# EAGLE design card (EAGLE 6.3)
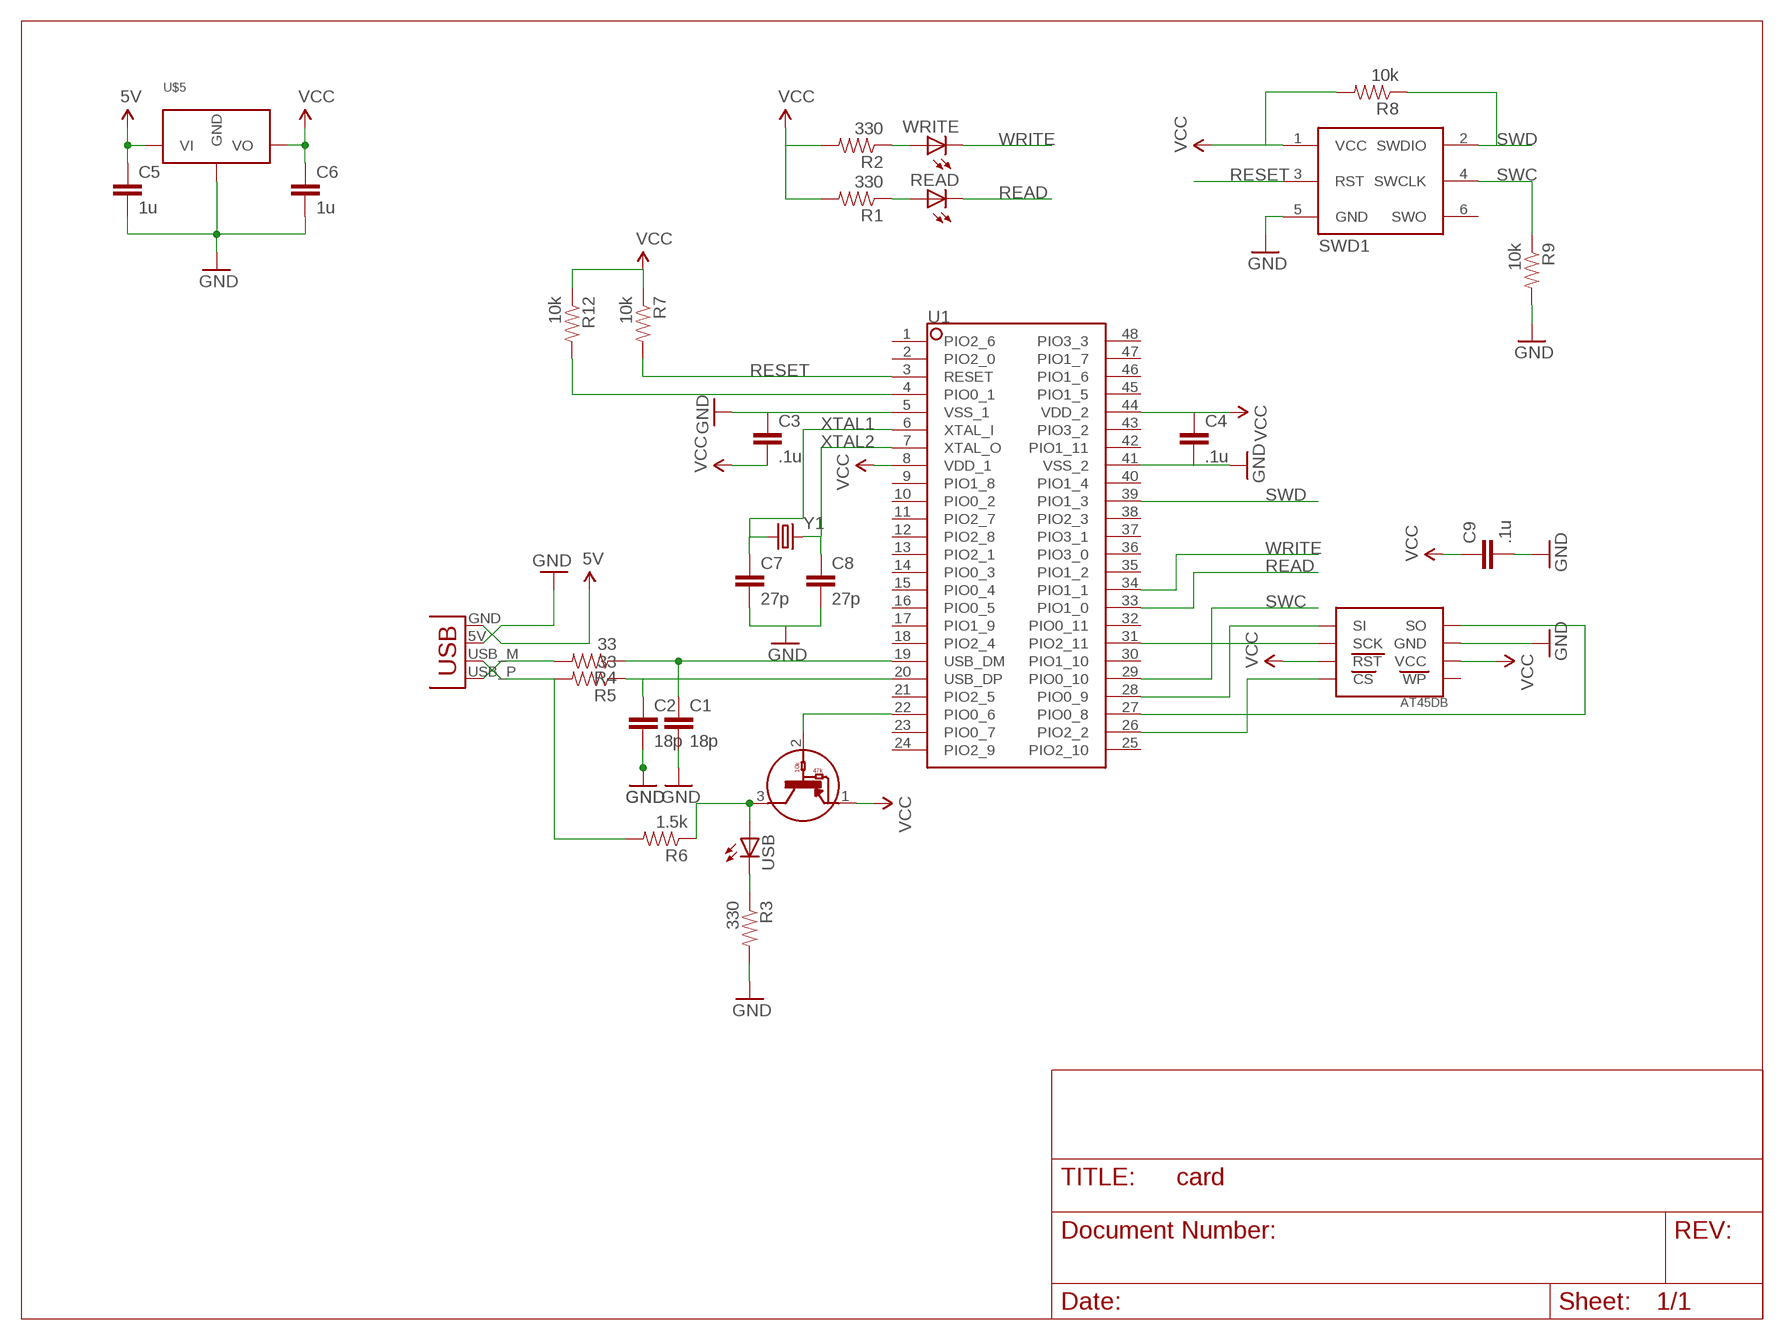
[diagram p0: schematic, sheet 1]

## Parts
AT45DB  AT45DBXXXD  [SOIC8]
C1  18p  CAP0805  [0805]
C2  18p  CAP0805  [0805]
C3  .1u  CAP1206  [1206]
C4  .1u  CAP1206  [1206]
C5  1u  CAP0805  [0805]
C6  1u  CAP0805  [0805]
C7  27p  CAP0805  [0805]
C8  27p  CAP0805  [0805]
C9  .1u  CAP0805  [0805]
JP1  USBPCB  [USB-A-PCB]
R1  330  RESISTOR0805-RES  [0805]
R2  330  RESISTOR0805-RES  [0805]
R3  330  RESISTOR0805-RES  [0805]
R4  33  RESISTOR0805-RES  [0805]
R5  33  RESISTOR0805-RES  [0805]
R6  1.5k  RESISTOR0805-RES  [0805]
R7  10k  RESISTOR0805-RES  [0805]
R8  10k  RESISTOR0805-RES  [0805]
R9  10k  RESISTOR0805-RES  [0805]
R12  10k  RESISTOR0805-RES  [0805]
READ  LED1206  [LED-1206]
SWD1  TC2030CTX_NL  [TC2030-NL]
U1  LPC1343FBD48  [LQFP48]
U3  DTA114YKA  [DTA114YKA]
U$5  3_3V_REG  [SOT23]
USB  LED1206  [LED-1206]
WRITE  LED1206  [LED-1206]
Y1  CRYSTAL5X3  [CRYSTAL-SMD-5X3]

## Nets
5V: C5.1 JP1.GND U$5.1(VI)
GND: AT45DB.7(GND) C1.2 C2.2 C3.1 C4.2 C5.2 C6.2 C7.2 C8.2 C9.2 JP1.5V(VBUS) R3.2 R9.2 SWD1.5(GND) U1.5(VSS_1) U1.41(VSS_2) U$5.3(GND)
N$1: C1.1 R4.1 U1.19(USB_DM)
N$3: JP1.USB_M(D-) R5.2 R6.2
N$4: C2.1 R5.1 U1.20(USB_DP)
N$5: AT45DB.2(SCK) U1.31(PIO2_11)
N$6: R1.1 READ.A
N$7: AT45DB.8(SO) U1.27(PIO0_8)
N$8: R2.1 WRITE.A
N$9: R6.1 U3.3 USB.A
N$10: R3.1 USB.C
N$11: U1.22(PIO0_6) U3.2
N$12: AT45DB.4(CS) U1.26(PIO2_2)
N$13: R12.2 U1.4(PIO0_1)
N$15: JP1.USB_P(D+) R4.2
READ: READ.C U1.33(PIO1_0)
RESET: R7.2 SWD1.3(RST) U1.3(RESET)
SWC: R9.1 SWD1.4(SWCLK) U1.29(PIO0_10)
SWD: R8.1 SWD1.2(SWDIO) U1.39(PIO1_3)
SWV: AT45DB.1(SI) U1.28(PIO0_9)
VCC: AT45DB.3(RST) AT45DB.6(VCC) C3.2 C4.1 C6.1 C9.1 R1.2 R2.2 R7.1 R8.2 R12.1 SWD1.1(VCC) U1.8(VDD_1) U1.44(VDD_2) U3.1 U$5.2(VO)
WRITE: U1.34(PIO1_1) WRITE.C
XTAL1: C7.1 U1.6(XTAL_I) Y1.1
XTAL2: C8.1 U1.7(XTAL_O) Y1.3
Unconnected: AT45DB.5(WP) SWD1.6(SWO) U1.1(PIO2_6) U1.2(PIO2_0) U1.9(PIO1_8) U1.10(PIO0_2) U1.11(PIO2_7) U1.12(PIO2_8) U1.13(PIO2_1) U1.14(PIO0_3) U1.15(PIO0_4) U1.16(PIO0_5) U1.17(PIO1_9) U1.18(PIO2_4) U1.21(PIO2_5) U1.23(PIO0_7) U1.24(PIO2_9) U1.25(PIO2_10) U1.30(PIO1_10) U1.32(PIO0_11) U1.35(PIO1_2) U1.36(PIO3_0) U1.37(PIO3_1) U1.38(PIO2_3) U1.40(PIO1_4) U1.42(PIO1_11) U1.43(PIO3_2) U1.45(PIO1_5) U1.46(PIO1_6) U1.47(PIO1_7) U1.48(PIO3_3)

## Library data of the parts
AT45DB = business:AT45DBXXXD
C1-C9 = SparkFun:CAP: Capacitor Standard 0603 ceramic capacitor, and 0.1" leaded capacitor.
JP1 = SparkFun-Connectors:USB: USB Connectors USB-B-PTH is fully proven SKU : PRT-00139/CONN-08278 USB-miniB is fully proven SKU : PRT-00587 USB-A-PCB is untested. USB-A-H is throughly reviewed, but untested. Spark Fun Electronics SKU : PRT-00437 USB-B-SMT is throughly reviewed, but untested. Needs silkscreen touching up. USB-A-S has not been used/tested USB-MB-H has not been used/tested USB-MICROB has been used. CONN-09505
R1-R9 R12 = SparkFun:RESISTOR: Resistor Basic schematic elements and footprints for 0603, 1206, and PTH resistors.
READ USB WRITE = SparkFun:LED: LEDs Standard schematic elements and footprints for 5mm, 3mm, 1206, and 0603 sized LEDs. 5mm - Spark Fun Electronics SKU : COM-00529 (and others)
SWD1 = tc:TC2030CTX_NL
U1 = ARM_LIB:LPC1343FBD48
U3 = carrilib:DTA114YKA
U$5 = carrilib:3_3V_REG
Y1 = SparkFun:CRYSTAL: Crystals Various standard crystals. Proven footprints. Spark Fun Electronics SKU : COM-00534

## Board
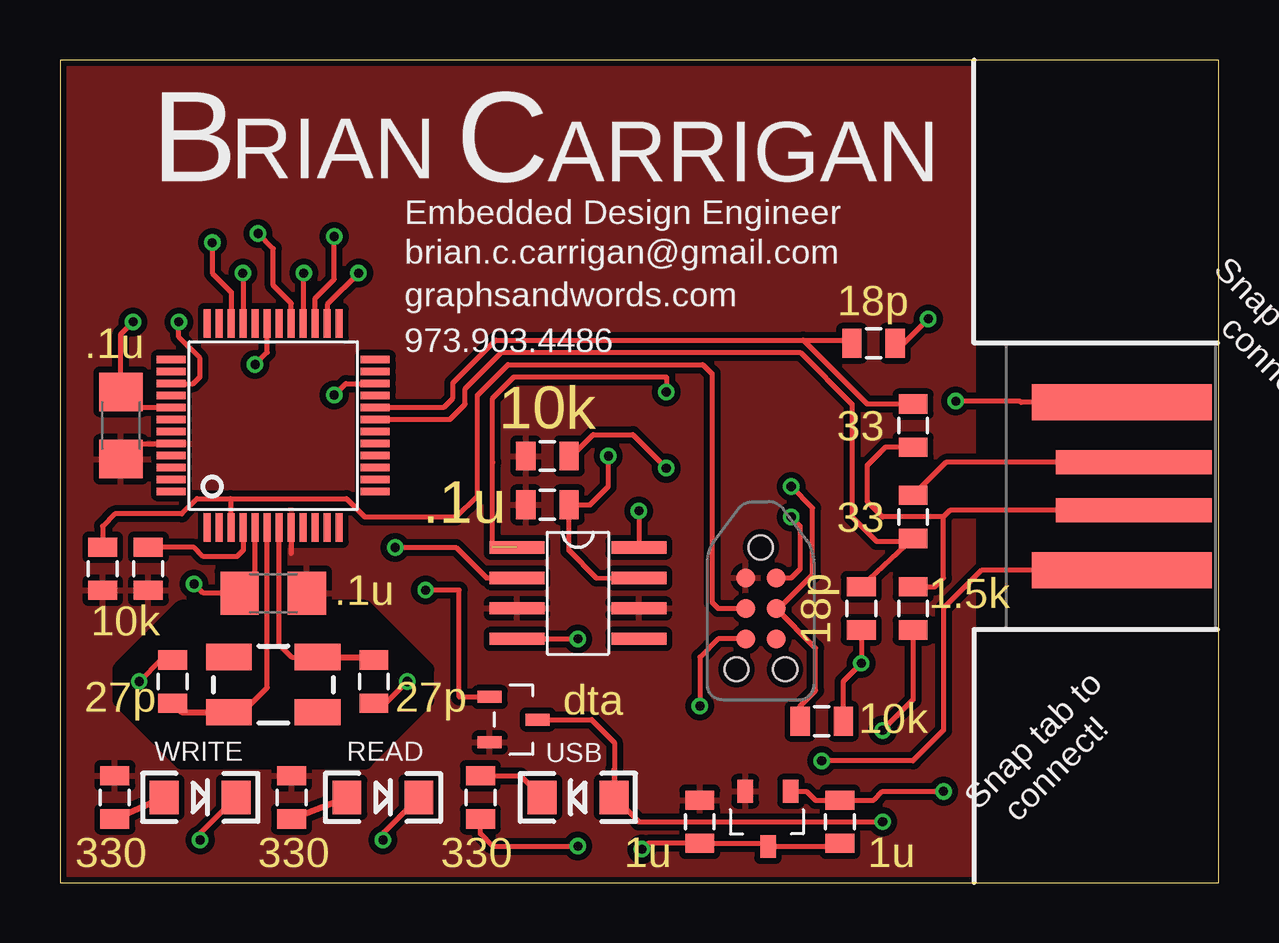
[diagram p1: board, top side]
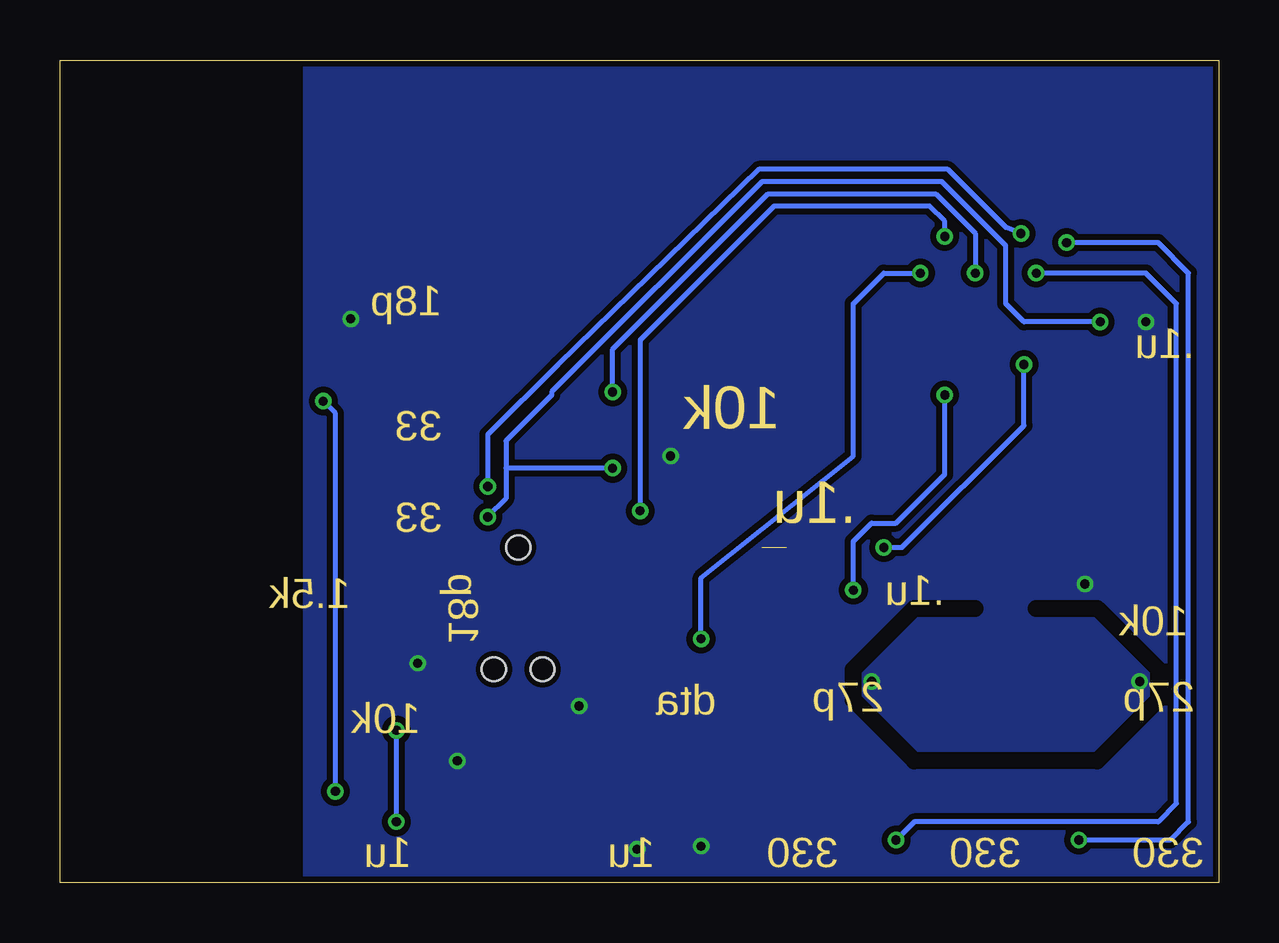
[diagram p2: board, bottom side, seen from below]

Size 48.31 x 34.28 mm. Coordinates in mm from the lower left corner, seen from the top.
Outline: 0,0 48.31,0 48.31,34.28 0,34.28 0,0
Copper layers (1*16): Top 0.035mm / dielectric 1.5mm / Bottom 0.035mm
Design rules: minimum track width 6mil, minimum drill 12mil, track to track 6mil, track to pad 6mil, pad to pad 6mil, via to via 6mil, smd to smd 0mil, copper to edge 10mil, drill to drill 10mil, minimum pad ring 10mil, minimum via ring 6mil, stop-mask expansion 2mil, vias tented up to drill 100mil, thermal gap 10mil
tRestrict: area 2.5,5.1 to 15.2,11.4
bRestrict: 9 lines

### Footprints (pad centres in the part's own frame; a part is rotated, then mirrored left to right if it is on the bottom)
SOIC8 = smd 0.508 x 2.286: 1 -1.27,-2.54; 2 0,-2.54; 3 1.27,-2.54; 4 2.54,-2.54; 5 2.54,2.54; 6 1.27,2.54; 7 0,2.54; 8 -1.27,2.54
0805 = smd 0.8 x 1.2: 1 -0.9,0; 2 0.9,0
1206 = smd 1.6 x 1.8: 1 -1.4,0; 2 1.4,0
USB-A-PCB = smd 7.5 x 1.5: 5V -0.2,-3.5; GND -0.2,3.5 | smd 6.5 x 1: USB_M 0.3,-1; USB_P 0.3,1
LED-1206 = smd 1.2 x 1.4: A -1.5,0; C 1.5,0
TC2030-NL = smd 0.787 x 0.787: 1 -0.635,1.27; 2 0.635,1.27; 3 -0.635,0; 4 0.635,0; 5 -0.635,-1.27; 6 0.635,-1.27 | hole 0.991: 1.016,-2.54; -1.016,-2.54; 0,2.54
LQFP48 = smd 1.2 x 0.3: 1 -4.25,2.75; 2 -4.25,2.25; 3 -4.25,1.75; 4 -4.25,1.25; 5 -4.25,0.75; 6 -4.25,0.25; 7 -4.25,-0.25; 8 -4.25,-0.75; 9 -4.25,-1.25; 10 -4.25,-1.75; 11 -4.25,-2.25; 12 -4.25,-2.75; 25 4.25,-2.75; 26 4.25,-2.25; 27 4.25,-1.75; 28 4.25,-1.25; 29 4.25,-0.75; 30 4.25,-0.25; 31 4.25,0.25; 32 4.25,0.75; 33 4.25,1.25; 34 4.25,1.75; 35 4.25,2.25; 36 4.25,2.75 | smd 0.3 x 1.2: 13 -2.75,-4.25; 14 -2.25,-4.25; 15 -1.75,-4.25; 16 -1.25,-4.25; 17 -0.75,-4.25; 18 -0.25,-4.25; 19 0.25,-4.25; 20 0.75,-4.25; 21 1.25,-4.25; 22 1.75,-4.25; 23 2.25,-4.25; 24 2.75,-4.25; 37 2.75,4.25; 38 2.25,4.25; 39 1.75,4.25; 40 1.25,4.25; 41 0.75,4.25; 42 0.25,4.25; 43 -0.25,4.25; 44 -0.75,4.25; 45 -1.25,4.25; 46 -1.75,4.25; 47 -2.25,4.25; 48 -2.75,4.25
DTA114YKA = smd 0.5 x 1: 1 1.9,0; 2 0,0; 3 0.95,2
SOT23 = smd 0.65 x 0.95: 1 -1,0; 2 0.9,0; 3 -0.05,2.3
CRYSTAL-SMD-5X3 = smd 1.9 x 1.1: 1 -1.85,-1.15; 2 1.85,-1.15; 3 1.85,1.15; 4 -1.85,1.15

### Placement (x,y rotation side)
AT45DB  21.59,12.7 270 top
C1  33.4,11.43 270 top
C2  33.91,22.48 0 top
C3  8.89,12.06 0 top
C4  2.54,19.05 90 top
C5  32.51,2.54 270 top
C6  26.67,2.54 270 top
C7  4.7,8.38 90 top
C8  13.08,8.38 270 top
C9  20.32,15.75 0 top
JP1  44.45,16.51 0 top
R1  9.65,3.56 90 top
R2  2.29,3.56 90 top
R3  17.53,3.56 270 top
R4  35.56,15.24 90 top
R5  35.56,19.05 270 top
R6  35.56,11.43 90 top
R7  1.78,13.08 90 top
R8  20.32,17.78 180 top
R9  31.75,6.73 0 top
R12  3.68,13.08 90 top
READ  13.46,3.56 0 top
SWD1  29.21,11.43 0 top
U1  8.89,19.05 90 top
U3  17.91,7.75 270 top
U$5  29.46,3.81 180 top
USB  21.59,3.56 180 top
WRITE  5.84,3.56 0 top
Y1  8.89,8.26 0 top

### Tracks (layer width: path | path; a pad name or v marks a point on that pad's centre or on a via)
5V  (via drill 0.38)
  Top 0.203: JP1.GND 40.06,20.01 40.01,20.07 v37.34,20.07 | v36.83,3.81 34.29,3.81 33.92,3.44 C5.1 32.5,3.43 31.5,3.43 31.11,3.81 U$5.1
  Bottom 0.203: v36.83,3.81 36.83,19.56 v37.34,20.07
GND  (via drill 0.38)
  Top 0.203: U1.5 8.14,12.71 C3.1 5.97,12.06 v5.59,12.45 | U1.41 3.19,19.8 C4.2 2.54,22.86 v3.05,23.37 | C7.2 4.2,9.28 v3.3,8.38 | C8.2 13.58,7.48 v14.48,8.38 | R3.2 17.53,2.03 18.03,1.52 v21.59,1.52 | AT45DB.7 22.36,12.69 21.21,13.84 C9.2 22.1,15.75 22.86,16.51 v22.86,17.78 | C2.2 35.18,22.48 v36.2,23.5 | SWD1.5 27.43,10.16 26.67,9.4 v26.67,7.37 | 33.4,10.54 C1.2 v33.4,9.14 32.65,8.39 R9.2 | v24.26,1.4 24.5,1.64 C6.2 29.38,1.64 U$5.3 32.38,1.51 | JP1.5V 38.41,13.01 36.83,11.43 36.83,6.35 35.56,5.08 v31.75,5.08
  Top 0.406: 32.38,1.51 C5.2
  pour Bottom (isolate 0.254): 0,-2.54 0,34.29 38.1,34.29 38.1,-2.54
N$1
  Top 0.203: C1.1 R4.1 35.44,14.22 34.04,14.22 33.02,15.24 33.02,19.94 30.86,22.1 18.41,22.1 16.89,20.57 16.89,19.94 16.26,19.3 U1.19
N$3
  Top 0.203: 36.83,15.24 34.29,15.24 33.66,15.88 33.66,17.4 34.42,18.16 35.55,18.16 R5.2 | 36.83,15.24 36.83,12.7 36.45,12.32 R6.2 | JP1.USB_M 37.1,15.51 36.83,15.24
N$4
  Top 0.203: R5.1 33.64,19.95 30.99,22.61 | 30.99,22.61 18.16,22.61 16.38,20.83 16.38,20.19 16,19.81 13.15,19.81 U1.20 | 30.99,22.61 32.88,22.61 C2.1
N$5  (via drill 0.38)
  Top 0.203: AT45DB.2 17.78,12.7 16.51,13.97 16.38,13.97 v13.97,13.97 | U1.31 8.64,22.1 v8.13,21.59
  Bottom 0.203: v13.97,13.97 13.21,13.97 8.13,19.05 v8.13,21.59
N$6
  Top 0.254: R1.1 READ.A
N$7  (via drill 0.38)
  Top 0.203: U1.27 10.64,24.36 11.43,25.15 v11.43,26.92 | v24.13,15.49 AT45DB.8
  Bottom 0.203: v11.43,26.92 11.43,27.56 12.06,28.19 18.54,28.19 24.13,22.61 v24.13,15.49
N$8
  Top 0.254: R2.1 WRITE.A
N$9  (via drill 0.38)
  Top 0.203: USB.A 23.09,4.71 23.11,4.74 | 23.11,4.74 23.11,5.84 22.16,6.8 U3.3 | 23.11,4.74 23.11,3.56 24.13,2.54 v34.29,2.54 | R6.1 35.56,7.62 v34.29,6.35
  Bottom 0.203: v34.29,2.54 v34.29,6.35
N$10
  Top 0.203: R3.1 19.19,4.46 USB.C
N$11  (via drill 0.38)
  Top 0.203: v15.24,12.19 16.64,12.19 16.64,7.75 U3.2 | U1.22 11.91,20.8 v11.43,20.32
  Bottom 0.203: v15.24,12.19 15.24,14.22 14.48,14.99 13.46,14.99 11.43,17.02 v11.43,20.32
N$12  (via drill 0.38)
  Top 0.203: U1.26 11.14,24.09 v12.45,25.4 | AT45DB.4 v21.59,10.16
  Bottom 0.203: v12.45,25.4 13.97,25.4 15.24,24.13 15.24,17.78 21.59,12.7 v21.59,10.16
N$13
  Top 0.203: U1.4 7.64,13.86 7.37,13.59 5.97,13.59 5.59,13.97 3.69,13.97 R12.2
N$15
  Top 0.203: JP1.USB_P 36.93,17.51 R4.2
READ  (via drill 0.38)
  Top 0.203: U1.33 7.64,25.38 v7.62,25.4 | v13.46,1.78 13.46,2.06 READ.C
  Bottom 0.203: v13.46,1.78 12.7,2.54 2.54,2.54 1.78,3.3 1.78,24.13 3.05,25.4 v7.62,25.4
RESET
  Top 0.203: 7.11,16 5.71,16 5.08,15.37 2.29,15.37 1.78,14.86 R7.2 | 7.11,16 7.11,14.83 U1.3 | 7.11,16 11.94,16 12.7,15.24 16.51,15.24 17.4,16.13 17.4,20.32 18.67,21.59 26.8,21.59 27.18,21.21 27.18,11.68 27.43,11.43 SWD1.3
SWC  (via drill 0.38)
  Top 0.203: U1.29 9.64,24.14 8.89,24.89 8.89,26.42 v8.26,27.05 | v30.48,16.51 31.37,15.62 31.37,12.83 29.97,11.43 SWD1.4 31.5,9.78 31.5,8 30.85,7.36 R9.1
  Bottom 0.203: v8.26,27.05 8.89,27.3 11.3,29.72 19.18,29.72 27.56,21.59 30.48,18.67 v30.48,16.51
SWD  (via drill 0.38)
  Top 0.203: U1.39 5.56,20.8 5.84,21.08 5.84,21.84 4.95,22.73 v4.95,23.37 | SWD1.2 30.48,12.7 30.86,13.08 30.86,14.86 v30.48,15.24 | R8.1 21.35,17.79 22.23,18.67 23.88,18.67 v25.27,17.27
  Bottom 0.203: v4.95,23.37 8.13,23.37 8.89,24.13 8.89,26.54 11.56,29.21 19.05,29.21 27.81,20.45 27.81,20.32 29.72,18.41 29.72,17.27 | 29.72,17.27 29.72,16 v30.48,15.24 | v25.27,17.27 29.72,17.27
SWV  (via drill 0.38)  (1 unrouted)
  Top 0.203: 18.03,13.97 18.03,17.53 | 18.03,17.53 18.03,20.19 18.92,21.08 25.27,21.08 v25.27,20.45 | 18.03,17.53 18.05,17.52 | U1.28 10.14,25.38 v10.16,25.4
  Bottom 0.203: v10.16,25.4 10.16,27.05 11.81,28.7 18.8,28.7 25.27,22.23 v25.27,20.45
VCC
  Top 0.203: C4.1 2.54,17.78 3.06,18.3 U1.44 5.07,18.3 5.08,18.29 4.83,18.29 | U1.8 9.64,13.73 9.65,13.72
  pour Top (isolate 0.254): 0,0 38.1,-1.27 38.1,34.29 0,34.29
WRITE  (via drill 0.38)
  Top 0.203: U1.34 7.14,24.61 6.35,25.4 v6.35,26.67 | v5.84,1.78 5.84,2.06 WRITE.C
  Bottom 0.203: v5.84,1.78 2.03,1.78 1.27,2.54 1.27,25.4 2.54,26.67 v6.35,26.67
XTAL1
  Top 0.203: U1.6 8.64,8.13 7.62,7.11 Y1.1
  Top 0.254: Y1.1 5.08,7.11 C7.1
XTAL2
  Top 0.203: U1.7 9.14,9.91 9.65,9.4 10.73,9.4 Y1.3
  Top 0.254: Y1.3 12.96,9.4 C8.1

### Text on the board
Dimension: 18p | .1u | 10k | 33 | .1u | 33 | .1u | 1.5k | 10k | 18p | 27p | 27p | dta | 10k | 330 | 330 | 330 | 1u | 1u
tPlace: B | RIAN | C | ARRIGAN | Embedded Design Engineer | brian.c.carrigan@gmail.com | graphsandwords.com | 973.903.4486 | Snap tab to / connect! | Snap tab to / connect!
201bmp: Manufaturing Notes: | 1. All manufacturing codes are to be placed / on the bottom of the PCB. | File Names: | Top Silkscreen: / Top Soldermask: / Top Copper: / Bottom Copper: / Bottom Soldermask: / Bottom Silkscreen: / / Board Outline: / Manufacturing Info: | card.GTO / card.GTS / card.GTL / card.GBL / card.GBS / NONE / / card.OLN / card.MANU